# EAGLE design tia-rev1 (EAGLE 9.6.2)
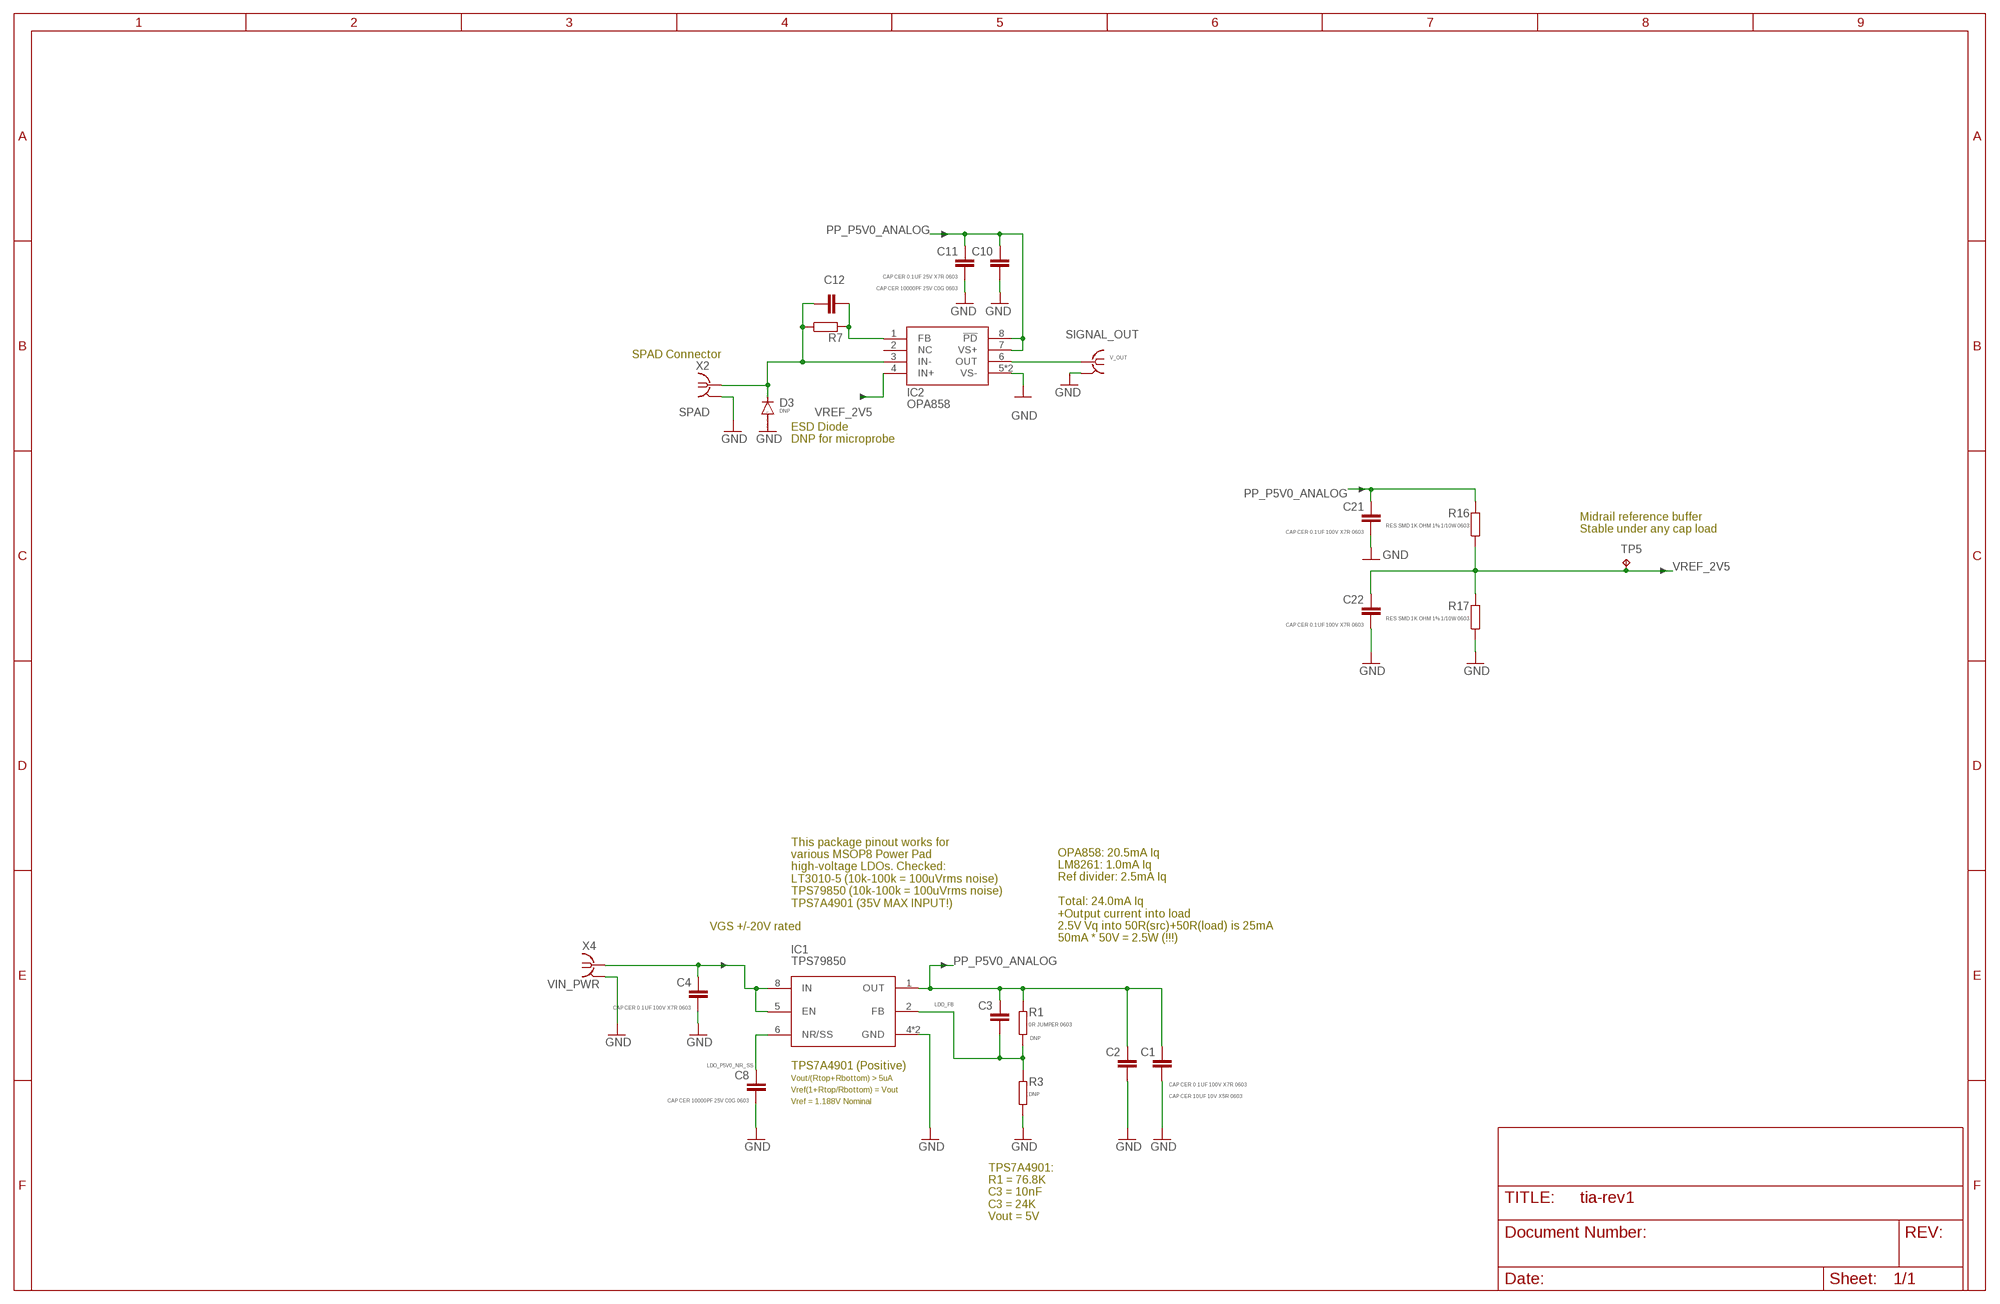
[diagram p0: schematic, sheet 1]

## Parts
C1  CAP CER 10UF 10V X5R 0603  C-EUC0603  [C0603]
C2  CAP CER 0.1UF 100V X7R 0603  C-EUC0603  [C0603]
C3  DNP  C-EUC0603  [C0603]
C4  CAP CER 0.1UF 100V X7R 0603  C-EUC0603  [C0603]
C8  CAP CER 10000PF 25V C0G 0603  C-EUC0603  [C0603]
C10  CAP CER 10000PF 25V C0G 0603  C-EUC0603  [C0603]
C11  CAP CER 0.1UF 25V X7R 0603  C-EUC0603  [C0603]
C12  CAP CER 0.1UF 25V X7R 0603  C-EUC0603  [C0603]
C21  CAP CER 0.1UF 100V X7R 0603  C-EUC0603  [C0603]
C22  CAP CER 0.1UF 100V X7R 0603  C-EUC0603  [C0603]
D3  DNP  DIODE-SOD323-W  [SOD323-W]
IC1  TPS79850  TPS7A  [MSOP-8_POWER_PAD]
IC2  OPA858  [WSON8]
R1  0R JUMPER 0603  R-EU_R0603  [R0603]
R3  DNP  R-EU_R0603  [R0603]
R7  DNP  R-EU_R0603  [R0603]
R16  RES SMD 1K OHM 1% 1/10W 0603  R-EU_R0603  [R0603]
R17  RES SMD 1K OHM 1% 1/10W 0603  R-EU_R0603  [R0603]
TP5  TPTP10R  [TP10R]
X2  SPAD  SMA-142-0701-881/886  [J502-ND-142-0701-881/886]
X3  SIGNAL_OUT  COAX  [MMCX-J-P-X-ST-EM1-MKT]
X4  VIN_PWR  COAX  [MMCX-J-P-X-ST-EM1-MKT]

## Nets
GND: C1.2 C2.2 C4.2 C8.2 C10.2 C11.2 C21.2 C22.2 D3.A IC1.4(GND) IC1.PAD(GND) IC2.5(VS-) IC2.PAD(VS-) R3.2 R17.1 X2.G@1(GND) X3.2@1(GND) X4.2@1(GND)
IN-: C12.1 D3.C IC2.3(IN-) R7.1 X2.1
LDO_FB: C3.2 IC1.2(FB) R1.1 R3.1
LDO_IN/EN: C4.1 IC1.5(EN) IC1.8(IN) X4.1
LDO_P5V0_NR_SS: C8.1 IC1.6(NR/SS)
N$1: IC2.4(IN+)
PP_P5V0_ANALOG: C1.1 C2.1 C3.1 C10.1 C11.1 C21.1 IC1.1(OUT) IC2.7(VS+) IC2.8(!PD) R1.2 R16.2
TIA_FB: C12.2 IC2.1(FB) R7.2
V_OUT: IC2.6(OUT) X3.1
VREF_2V5: C22.1 R16.1 R17.2 TP5.TP
Unconnected: IC2.2(NC)

## Notes on the sheet
- SPAD Connector
- ESD Diode
  DNP for microprobe
- Midrail reference buffer
  Stable under any cap load
- This package pinout works for
  various MSOP8 Power Pad
  high-voltage LDOs. Checked:
  LT3010-5 (10k-100k = 100uVrms noise)
  TPS79850 (10k-100k = 100uVrms noise)
  TPS7A4901 (35V MAX INPUT!)
- VGS +/-20V rated
- OPA858: 20.5mA Iq
  LM8261: 1.0mA Iq
  Ref divider: 2.5mA Iq
  
  Total: 24.0mA Iq
  +Output current into load
  2.5V Vq into 50R(src)+50R(load) is 25mA
  50mA * 50V = 2.5W (!!!)
- TPS7A4901 (Positive)
- Vout/(Rtop+Rbottom) > 5uA
- Vref(1+Rtop/Rbottom) = Vout
- Vref = 1.188V Nominal
- TPS7A4901:
  R1 = 76.8K
  C3 = 10nF
  C3 = 24K
  Vout = 5V

## Power pins joined to a net without a drawn wire
GND: X2.G@2(GND) X2.G@3(GND) X2.G@4(GND) X3.2@2(GND) X3.2@3(GND) X3.2@4(GND) X4.2@2(GND) X4.2@3(GND) X4.2@4(GND)

## Library data of the parts
C1-C4 C8 C10-C12 C21 C22 = rcl-modified-footprints:C-EU: CAPACITOR, European symbol
D3 = diode:DIODE-: DIODE
IC1 = Kramnik's Library:TPS7A*
IC2 = meng:OPA858
R1 R3 R7 R16 R17 = rcl-modified-footprints:R-EU_: RESISTOR, European symbol
TP5 = testpad:TP: Test pad
X2 = meng:SMA-: SMA 50 Ohm End Launch Jack Receptacle - Round Contact Johnson Components Source: www.johnsoncomponents.com .. J502-ND.pdf; MF: JOHNSON COMPONENTS; MPN: 142-0701-881; OC_FARNELL: 1608603; OC_NEWARK: 08B906
X3 X4 = con-samtec:COAX: MMCX STRAIGHT, EDGE MOUNT JACK- 50 OHM Source: http://www.samtec.com/ftppub/cpdf/MMCX-J-P-X-ST-EM1-MKT.pdf; MF: Samtec Inc.; MPN: MMCX-J-P-X-ST-EM1-MKT; OC_FARNELL: unknown; OC_NEWARK: unknown

## Net classes
1 100OHM_DIFF: width 0.254 mm, clearance 0.254 mm

## Board
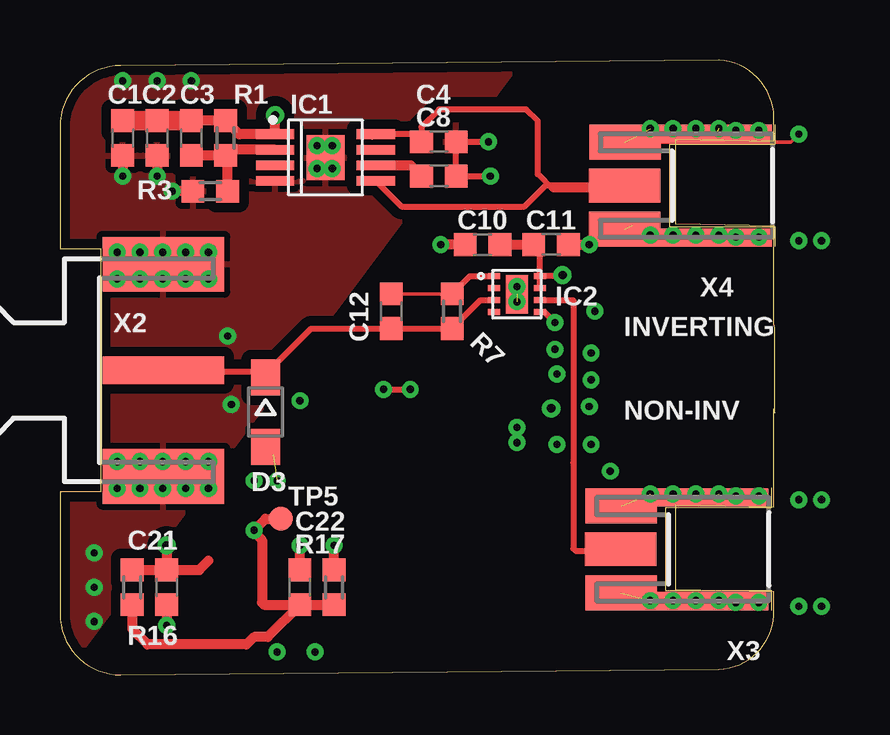
[diagram p1: board, top side]
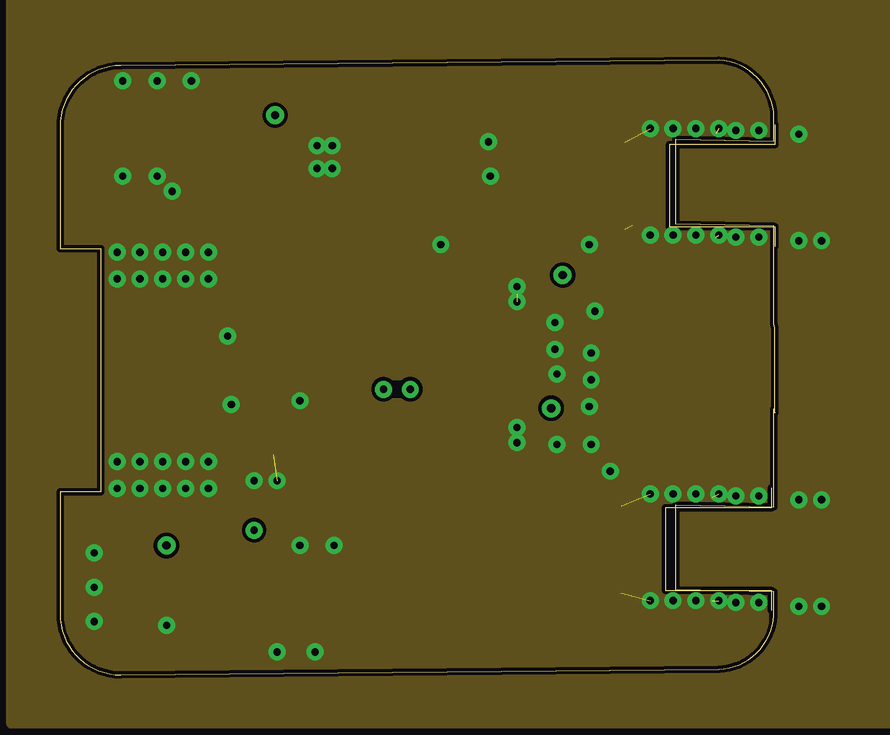
[diagram p2: board, inner layer Route2]
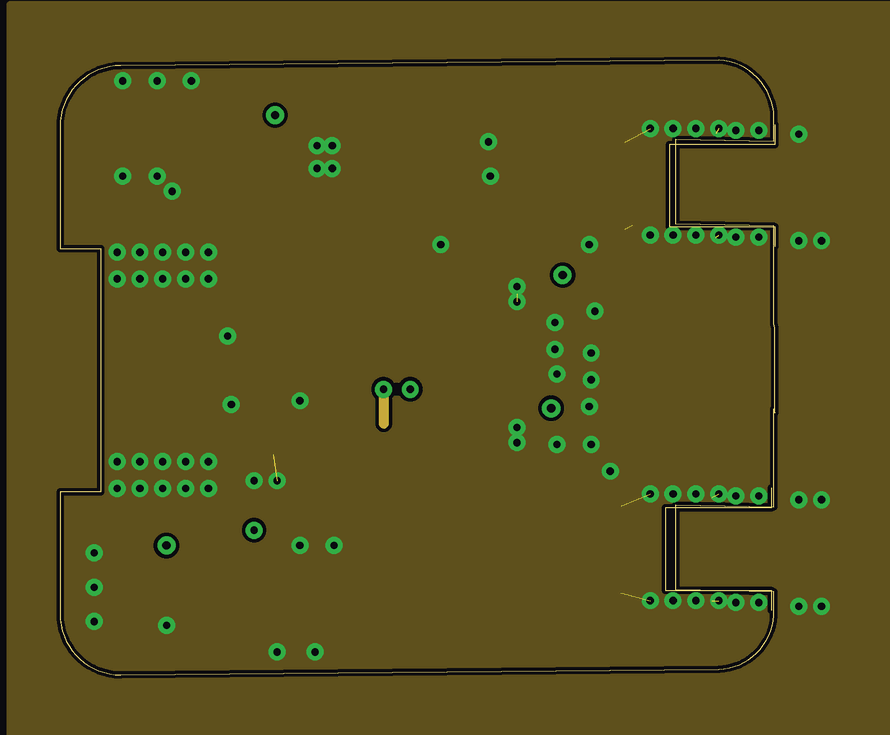
[diagram p3: board, inner layer Route15]
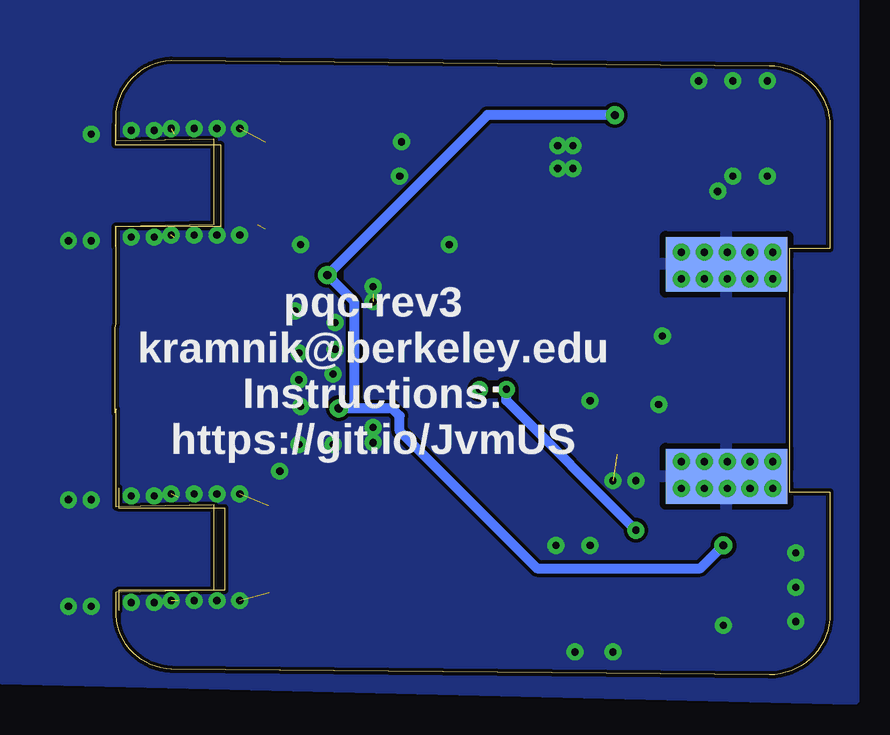
[diagram p4: board, bottom side, seen from below]

Size 29.81 x 25.64 mm. Coordinates in mm from the lower left corner, seen from the top.
Outline: 0,7.62 0,2.54 arc90 2.54,0 27.46,0.24 arc90 29.77,2.7 29.77,3.47 25.67,3.55 25.67,7.09 29.77,7.01 29.77,11.09 29.79,10.93 29.79,14.47 29.77,14.63 29.77,18.71 25.67,18.79 25.67,22.33 29.77,22.25 29.77,23.02 arc90 27.46,25.64 2.54,25.4 arc90 0,22.86 0,17.78 1.7,17.78 1.7,7.62 0,7.62
Copper layers (1+2*15+16): Top 0.035mm / dielectric 1.5mm / Route2 0.035mm / dielectric 0.15mm / Route15 0.035mm / dielectric 0.2mm / Bottom 0.035mm
Design rules "default *": minimum track width 6mil, minimum drill 0.3mm, track to track 6mil, track to pad 6mil, pad to pad 6mil, via to via 6mil, smd to smd 0mil, copper to edge 6mil, drill to drill 6mil, minimum pad ring 10mil, minimum via ring 8mil, stop-mask expansion 2mil, vias tented up to drill 0.35mm, thermal gap 10mil

### Footprints (pad centres in the part's own frame; a part is rotated, then mirrored left to right if it is on the bottom)
C0603 = smd 0.95 x 0.95: 1 -0.725,0; 2 0.725,0
SOD323-W = smd 1.5 x 1.2: A 1.45,0; C -1.45,0
MSOP-8_POWER_PAD = smd 0.4 x 1.6: 1 0,0; 2 0.65,0; 3 1.3,0; 4 1.95,0; 5 1.95,4.2; 6 1.3,4.2; 7 0.65,4.2; 8 0,4.2 | smd 1.89 x 1.57: PAD 0.975,2.1
WSON8 = smd 0.5 x 0.25: 1 -0.95,0.75; 2 -0.95,0.25; 3 -0.95,-0.25; 4 -0.95,-0.75; 5 0.95,-0.75; 6 0.95,-0.25; 7 0.95,0.25; 8 0.95,0.75 | smd 0.9 x 1.6: PAD 0,0
R0603 = smd 0.95 x 0.95: 1 -0.725,0; 2 0.725,0
TP10R = smd 1 x 1: TP 0,0
J502-ND-142-0701-881/886 = smd 5.08 x 1.143: 1 2.565,0 | smd 5.08 x 2.286: G@1 2.565,4.42; G@2 2.565,-4.42 | smd 5.08 x 2.286 bottom: G@3 2.565,4.42; G@4 2.565,-4.42
MMCX-J-P-X-ST-EM1-MKT = smd 1.4 x 2.975: 1 0,-6.15 | smd 1.46 x 2.975: 2@1 -1.812,-6.125; 2@2 1.812,-6.138 | smd 0.76 x 4.7: 2@3 -2.163,-2.35; 2@4 2.163,-2.35

### Placement (x,y rotation side)
C1  2.62,22.38 270 top
C2  4.05,22.38 270 top
C3  5.48,22.38 270 top
C4  15.8,22.23 0 top
C8  15.8,20.8 0 top
C10  17.62,17.94 180 top
C11  20.48,17.94 0 top
C12  13.81,15.16 90 top
C21  4.45,3.65 270 top
C22  10,3.65 90 top
D3  8.57,10.95 270 top
IC1  8.97,22.54 270 top
IC2  19.05,15.88 0 top
R1  6.91,22.38 90 top
R3  6.27,20.16 180 top
R7  16.35,15.16 90 top
R16  3.02,3.65 90 top
R17  11.43,3.65 270 top
TP5  9.21,6.51 0 top
X2  1.75,12.7 0 top
X3  29.53,5.24 270 top
X4  29.69,20.4 270 top

### Tracks (layer width: path | path; a pad name or v marks a point on that pad's centre or on a via)
GND  (via drill 0.3)  (10 unrouted)
  Top 0.152: v30.8,22.54 30.47,22.21 X4.2@1
  Top 0.254: IC2.5 20.2,15.12 v20.64,14.68 | v17.94,20.8 C8.2 C4.2 v17.86,22.23
  Top 0.406: C11.2 v22.07,17.94 | C10.2 v15.88,17.94 | D3.A 8.89,9.19 | R3.2 v4.68,20.16 | 23.87,18.75 24.28,18.34 v24.61,18.34 | R17.1 v11.43,5.4 | C21.2 v4.45,2.06 | C22.2 v10,5.4 | C1.2 v2.62,20.8 | C2.2 v4.05,20.8
  other vias: 8.1,8.1 9.05,8.1 19.05,16.19 19.05,15.56 19.05,10.32 19.05,9.68 10.72,22.07 11.35,22.07 11.35,21.11 10.72,21.11 29.13,22.7 28.18,22.7 27.46,22.78 26.51,22.78 25.56,22.78 24.61,22.78 30.8,18.1 31.75,18.1 25.56,18.34 26.51,18.34 27.46,18.34 28.18,18.26 29.13,18.26 4.29,8.89 4.29,16.51 5.24,8.89 6.19,8.89 3.33,8.89 2.38,8.89 5.24,16.51 6.19,16.51 3.33,16.51 2.38,16.51 29.13,3.02 28.18,3.02 27.46,3.1 26.51,3.1 25.56,3.1 24.61,3.1 31.75,2.86 30.8,2.86 29.13,7.46 28.18,7.46 27.46,7.54 26.51,7.54 25.56,7.54 24.61,7.54 31.75,7.3 30.8,7.3 10.64,0.95 9.05,0.95 2.62,24.77 4.05,24.77 5.48,24.77 22.15,13.41 22.15,12.3 22.94,8.49 22.15,9.6 22.07,11.19 22.3,15.16 20.64,13.57 20.72,12.54 20.72,9.6 2.38,7.78 3.33,7.78 4.29,7.78 5.24,7.78 6.19,7.78 2.38,17.62 3.33,17.62 4.29,17.62 5.24,17.62 6.19,17.62 6.99,14.13 7.14,11.27 10,11.43 1.43,3.65 1.43,2.22 1.43,5.08
  pour Bottom: -1,30.48 40.64,30.48 40.64,0 -1,-1
  pour Route2 (rank 6): -2,39.3 82,39.3 82,-2 -2,-2
  pour Top (isolate 0.406, rank 2): 0.08,25.4 19.01,25.4 0,-0.11
  pour Route15: -2.06,27.94 42.7,27.94 42.7,-6.19 -2.06,-6.19
IN-
  Top 0.152: D3.C 8.5,12.47 8.36,12.62 | 4.39,12.62 X2.1
  Top 0.254: 8.36,12.62 4.39,12.62 | 8.5,12.47 10.47,14.44 C12.1 R7.1 17.54,15.62 IC2.3
LDO_FB
  Top 0.406: IC1.2 7.14,21.89 R1.1 | R1.1 C3.2 | R3.1 7,21.57 R1.1
LDO_IN/EN
  Top 0.152: IC1.8 13.01,22.39 12.94,22.46 | 19.92,23.02 19.92,23.1 | IC1.5 13.13,20.56
  Top 0.254: 19.92,23.02 19.92,20.88 20.56,20.24 23.38,20.24 X4.1 20.24,20.4 19.37,19.53 14.24,19.53 IC1.5 | 19.92,23.1 19.45,23.57 15.8,23.57 15.07,22.85 C4.1 14.75,22.54 IC1.8
LDO_P5V0_NR_SS
  Top 0.406: IC1.6 14.62,21.24 C8.1
PP_P5V0_ANALOG  (via drill 0.35)
  Top 0.254: IC2.7 IC2.8 | v20.95,16.67 20.91,16.62 IC2.8 | IC2.8 20,17.69 C11.1
  Top 0.406: C3.1 R1.2 7.47,22.54 IC1.1 v8.97,23.34 | C21.1 5.8,4.38 6.19,4.76 | C10.1 C11.1 19.84,17.85 | R16.2 C21.1 | v4.45,5.4 C21.1
  Top 0.813: C1.1 C2.1 C3.1
  Bottom 0.406: 19.84,11.11 18.26,11.11 17.94,10.79 17.94,10.16 12.22,4.45 5.4,4.45 v4.45,5.4 | 19.84,11.11 v20.48,11.11 | 19.84,11.11 19.84,15.56 v20.95,16.67 14.29,23.34 v8.97,23.34
TIA_FB
  Top 0.152: R7.2 C12.2 | 18.06,16.59 IC2.1
  Top 0.254: IC2.1 17.3,16.62 17.09,16.62 R7.2
V_OUT
  Top 0.152: 23.3,5.16 X3.1
  Top 0.254: IC2.6 21.4,15.62 21.4,8.84 21.4,5.27 21.51,5.16 21.75,5.16 23.3,5.16
VREF_2V5  (via drill 0.3)
  Top 0.152: 8.43,3 8.5,2.93
  Top 0.254: v13.49,11.91 v14.61,11.91
  Top 0.406: R16.1 3.02,1.91 3.65,1.27 7.78,1.27 8.09,1.58 8.66,1.58 C22.1 | TP5.TP 8.57,6.51 v8.1,6.03 8.1,5.95 8.43,5.62 8.43,3 | 10,3.1 C22.1 | C22.1 R17.2 | 8.5,2.93 C22.1
  Route15 0.406: v13.49,11.91 13.49,10.48
  Bottom 0.406: v8.1,6.03 13.49,11.43 v13.49,11.91

### Text on the board
tPlace: INVERTING | NON-INV
bPlace: pqc-rev3 / kramnik@berkeley.edu / Instructions: / https://git.io/JvmUS